# Altium schematic sheet Connectors.SchDoc
size A; SheetNumber: 2
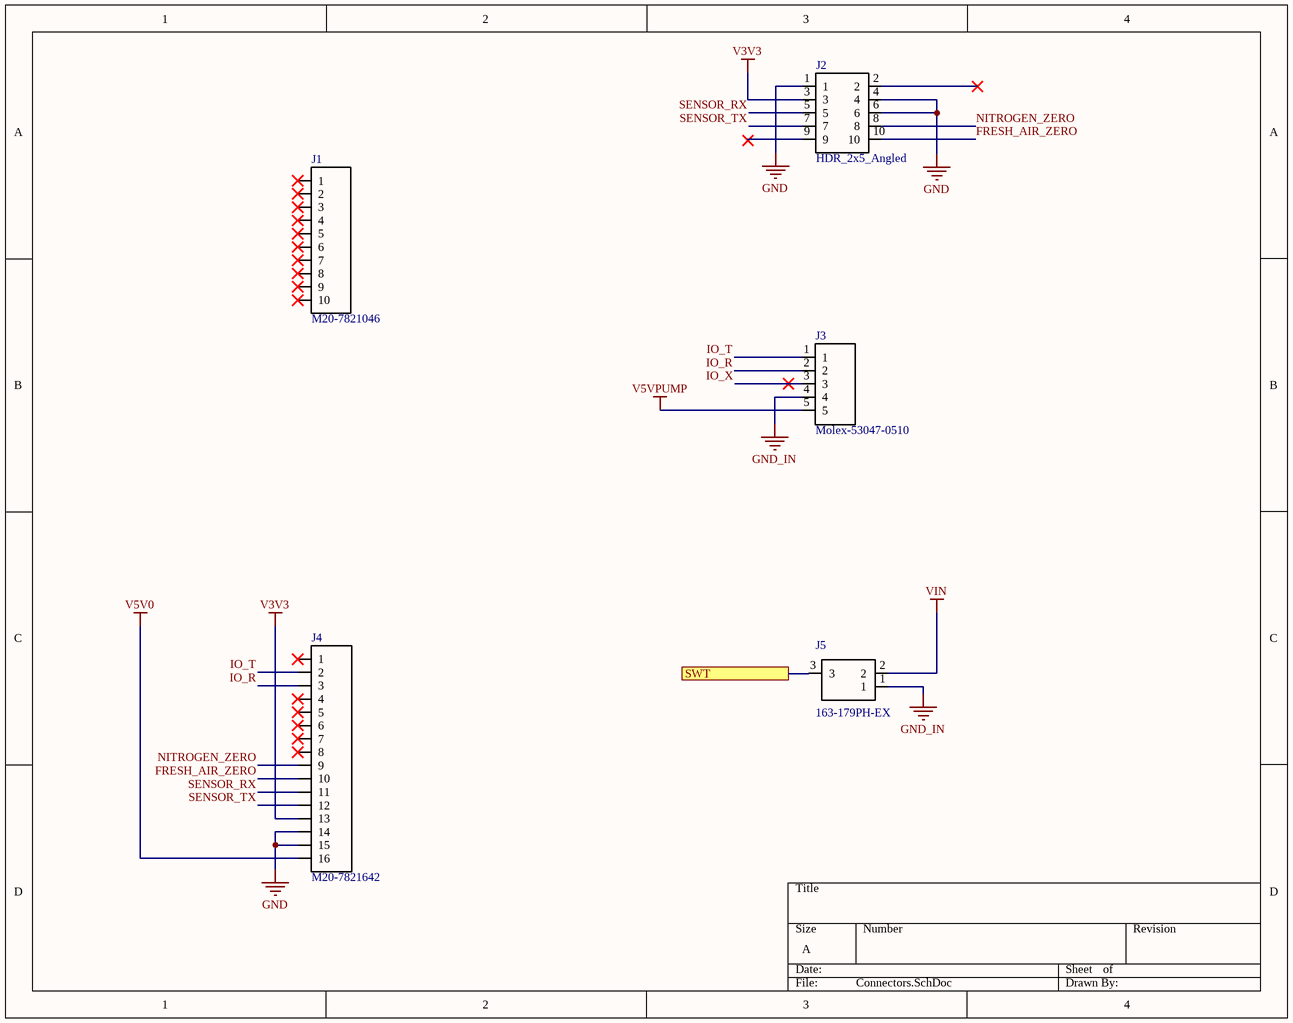
[diagram p0: Connectors.SchDoc]

## Parts
J1  M20-7821046  [HDR1X10]
J2  HDR_2x5_Angled  [HDR2X5]
J3  Molex-53047-0510  [SHDR5W36P0X125_1X5_800X320X420P]
J4  M20-7821642  [HDR1X16]
J5  163-179PH-EX  [163179PHEX]

## Ports
SWT

## Nets
GND: J2.1 J2.4 J2.6 J4.14 J4.15
GND_IN: J3.4 J5.1
V3V3: J2.3 J4.13
V5V0: J4.16
V5VPUMP: J3.5
VIN: J5.2
FRESH_AIR_ZERO: J2.10 J4.10
IO_R: J3.2 J4.3
IO_T: J3.1 J4.2
IO_X: J3.3
NITROGEN_ZERO: J2.8 J4.9
SENSOR_RX: J2.5 J4.11
SENSOR_TX: J2.7 J4.12
SWT: J5.3 ; port SWT

Not connected (* = marked no-connect by the designer): J1 1* 2* 3* 4* 5* 6* 7* 8* 9* 10*; J2 2* 9*; J4 1* 4* 5* 6* 7* 8*

## Library data of the parts
J1 = M20-7821046: Connector; Manufacturer_Name: HARWIN; Datasheet Link: https://componentsearchengine.com//M20-7821046.pdf; Height: 8.65mm; Mouser2 Part Number: 855-M20-7821046; Mouser2 Price/Stock: https://www.mouser.com/Search/Refine.aspx?Keyword=855-M20-7821046; Manufacturer_Part_Number: M20-7821046
J2 = HDR_2x5_Angled: Connector; Manufacturer_Name: Wurth Elektronik; Manufacturer_Part_Number: 613010243121; Datasheet Link: https://componentsearchengine.com//613010243121.pdf; Mouser2 Part Number: 710-613010243121; Mouser2 Price/Stock: https://www.mouser.com/Search/Refine.aspx?Keyword=710-613010243121
J3 = Molex-53047-0510: Connector; Manufacturer_Name: Molex; Datasheet Link: https://componentsearchengine.com/Datasheets/1/53047-0510.pdf; Height: 4.2mm; Mouser2 Part Number: 538-53047-0510; Mouser2 Price/Stock: https://www.mouser.com/Search/Refine.aspx?Keyword=538-53047-0510; Manufacturer_Part_Number: 53047-0510
J4 = M20-7821642: Connector; Manufacturer_Name: HARWIN; Datasheet Link: https://componentsearchengine.com//M20-7821642.pdf; Height: 8.65mm; Mouser2 Part Number: 855-M20-7821642; Mouser2 Price/Stock: https://www.mouser.com/Search/Refine.aspx?Keyword=855-M20-7821642; Manufacturer_Part_Number: M20-7821642
J5 = 163-179PH-EX: Connector; Manufacturer_Name: Kobiconn; Datasheet Link: https://componentsearchengine.com/Datasheets/1/163-179PH-EX.pdf; Height: 11mm; Mouser2 Part Number: 163-179PH-EX; Manufacturer_Part_Number: 163-179PH-EX